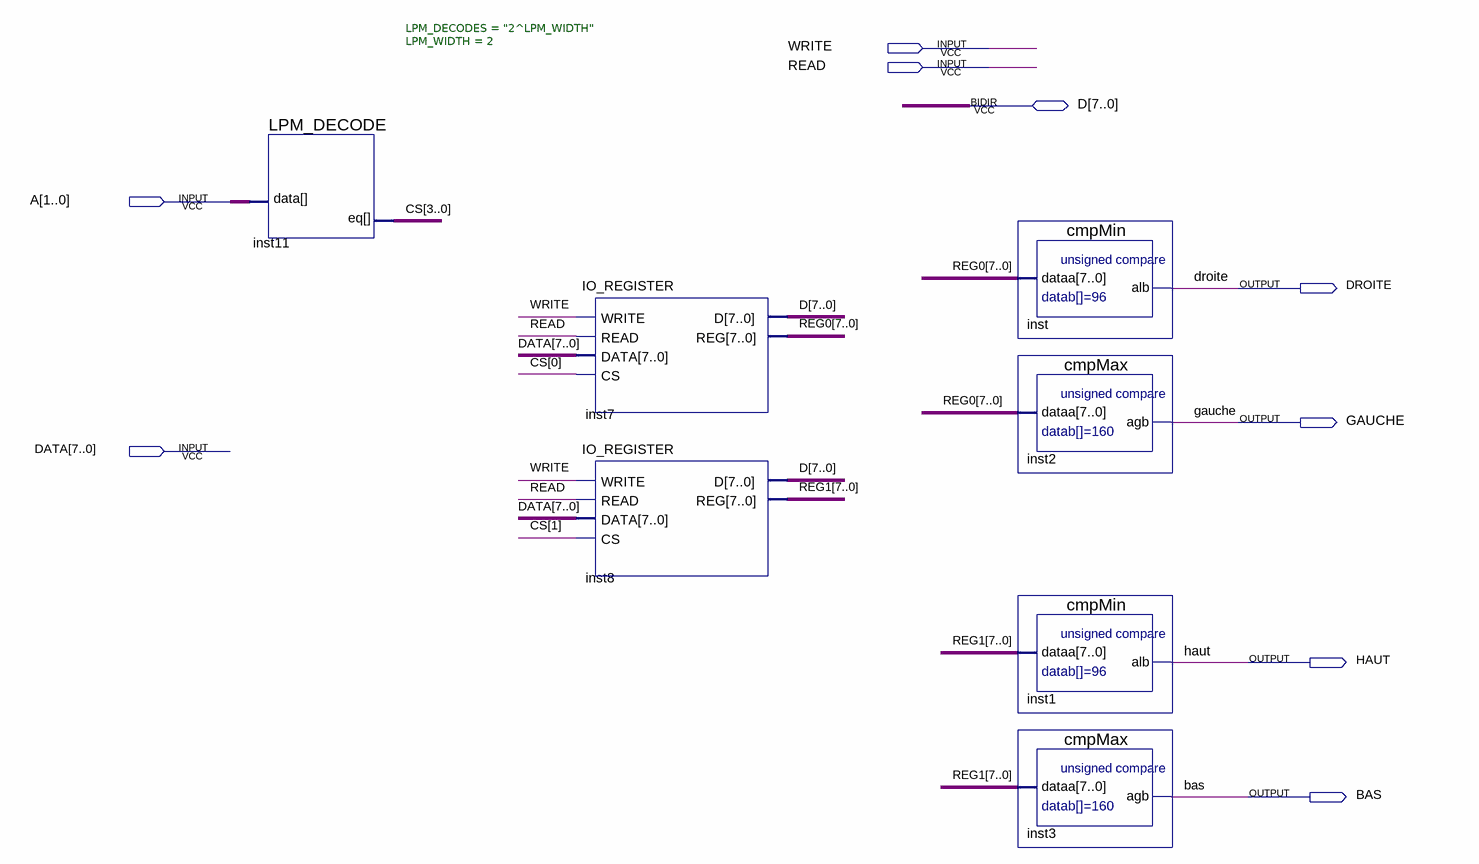
[diagram p0: schematic sheet]
// Quartus schematic Joystick.bdf as structural Verilog: 7 symbols, 9 pins
module Joystick (
  input  WRITE,
  input  READ,
  input  [1:0] A,
  input  [7:0] DATA,
  inout  [7:0] D,
  output DROITE,
  output GAUCHE,
  output HAUT,
  output BAS
);

  wire [3:0] CS;
  wire [7:0] REG0, REG1;

  LPM_DECODE #(.LPM_DECODES("2^LPM_WIDTH"), .LPM_WIDTH(2)) inst11 (.data(A), .eq(CS));
  IO_REGISTER inst7 (.WRITE(WRITE), .READ(READ), .DATA(DATA), .CS(CS[0]), .REG(REG0), .D(D));
  IO_REGISTER inst8 (.WRITE(WRITE), .READ(READ), .DATA(DATA), .CS(CS[1]), .REG(REG1), .D(D));
  cmpMin inst (.dataa(REG0), .alb(DROITE));
  cmpMax inst2 (.dataa(REG0), .agb(GAUCHE));
  cmpMin inst1 (.dataa(REG1), .alb(HAUT));
  cmpMax inst3 (.dataa(REG1), .agb(BAS));
endmodule
